# Altium schematic sheet zigbee_easy_module.SchDoc
size A3
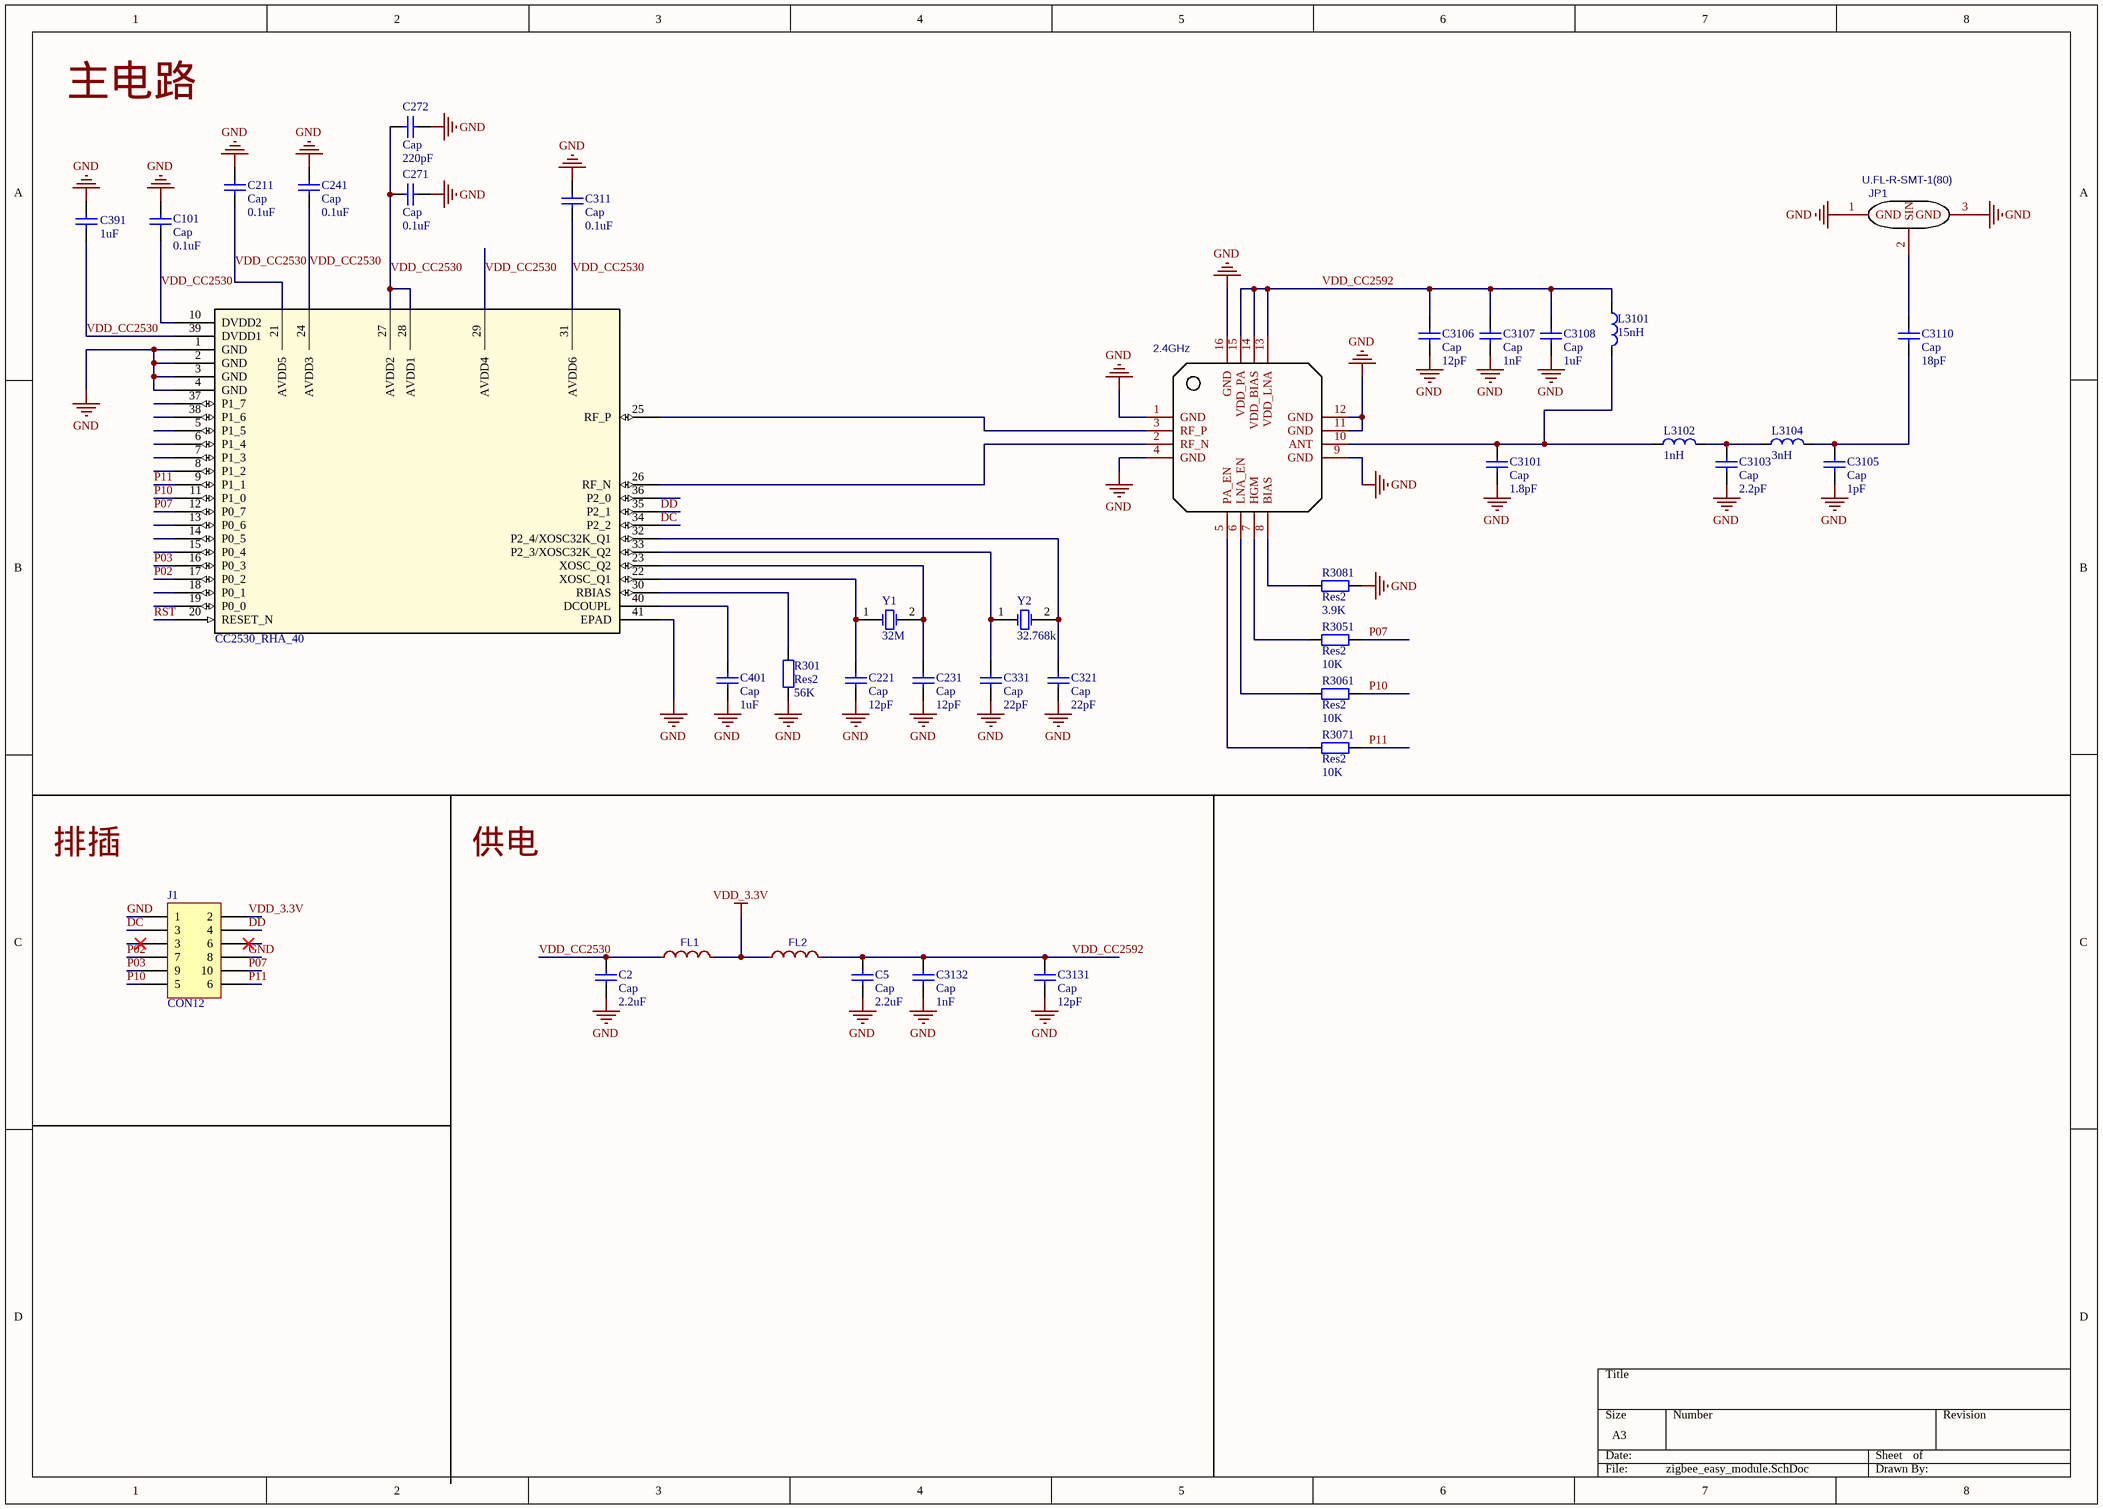
[diagram p0: zigbee_easy_module.SchDoc]

## Parts
(Parts that share a designator on the sheet are numbered #1, #2 ... from top to bottom, then left to right.)
?#1  CC2530_RHA_40  [QFN-40_6X6X05P]
?#2  2.4GHz  [VQFN-16_L4.0-W4.0-P0.65-BL-EP]
C2  Cap  value 2.2uF  [0201]
C5  Cap  value 2.2uF  [0201]
C101  Cap  value 0.1uF  [0201]
C211  Cap  value 0.1uF  [0201]
C221  Cap  value 12pF  [0201]
C231  Cap  value 12pF  [0201]
C241  Cap  value 0.1uF  [0201]
C271  Cap  value 0.1uF  [0201]
C272  Cap  value 220pF  [0201]
C311  Cap  value 0.1uF  [0201]
C321  Cap  value 22pF  [0201]
C331  Cap  value 22pF  [0201]
C391  value 1uF  [0201]
C401  Cap  value 1uF  [0201]
C3101  Cap  value 1.8pF  [0402]
C3103  Cap  value 2.2pF  [0402]
C3105  Cap  value 1pF  [0402]
C3106  Cap  value 12pF  [0201]
C3107  Cap  value 1nF  [0201]
C3108  Cap  value 1uF  [0201]
C3110  Cap  value 18pF  [0402]
C3131  Cap  value 12pF  [0201]
C3132  Cap  value 1nF  [0201]
FL1  (no value)  [0402]
FL2  (no value)  [0402]
J1  CON12  [210S-2.54-2X6P]
JP1  U.FL-R-SMT-1(80)  [U.FL-R-SMT-1(80)]
L3101  15nH  [0402]
L3102  1nH  [0402]
L3104  3nH  [0402]
R301  Res2  value 56K  [0201]
R3051  Res2  value 10K  [0201]
R3061  Res2  value 10K  [0201]
R3071  Res2  value 10K  [0201]
R3081  Res2  value 3.9K  [0201]
Y1  32M  [OSC-SMD_4P-L3.2-W2.5-BL]
Y2  32.768k  [OSC-SMD_L3.2-W1.5]

## Nets
GND: ?#1.1(GND) ?#1.2(GND) ?#1.3(GND) ?#1.4(GND) ?#1.41(EPAD) ?#2.1(GND) ?#2.4(GND) ?#2.9(GND) ?#2.11(GND) ?#2.12(GND) ?#2.16(GND) C2.1 C5.1 C101.1 C211.2 C221.1 C231.1 C241.2 C271.1 C272.1 C311.1 C321.1 C331.1 C391.2 C401.2 C3101.2 C3103.2 C3105.2 C3106.2 C3107.2 C3108.2 C3131.1 C3132.1 J1.1 J1.8 JP1.1(GND) JP1.3(GND) R301.2 R3081.2
VDD_3.3V: FL1.2 FL2.1 J1.2
DC: ?#1.34(P2_2) J1.3
DD: ?#1.35(P2_1) J1.4
P02: ?#1.17(P0_2) J1.7
P03: ?#1.16(P0_3) J1.9
P07: ?#1.12(P0_7) J1.10 R3051.2
P10: ?#1.11(P1_0) J1.5 R3061.2
P11: ?#1.9(P1_1) J1.6 R3071.2
RST: ?#1.20(RESET_N)
VDD_CC2530: ?#1.10(DVDD2) ?#1.21(AVDD5) ?#1.24(AVDD3) ?#1.27(AVDD2) ?#1.28(AVDD1) ?#1.29(AVDD4) ?#1.31(AVDD6) ?#1.39(DVDD1) C2.2 C101.2 C211.1 C241.1 C271.2 C272.2 C311.2 C391.1 FL1.1
VDD_CC2592: ?#2.13(VDD_LNA) ?#2.14(VDD_BIAS) ?#2.15(VDD_PA) C5.2 C3106.1 C3107.1 C3108.1 C3131.2 C3132.2 FL2.2 L3101.1
Net?#1_22: ?#1.22(XOSC_Q1) C221.2 Y1.1(OSC1)
Net?#1_23: ?#1.23(XOSC_Q2) C231.2 Y1.2(OSC2)
Net?#1_25: ?#1.25(RF_P) ?#2.3(RF_P)
Net?#1_26: ?#1.26(RF_N) ?#2.2(RF_N)
Net?#1_30: ?#1.30(RBIAS) R301.1
Net?#1_32: ?#1.32(P2_4/XOSC32K_Q1) C321.2 Y2.2(OSC2)
Net?#1_33: ?#1.33(P2_3/XOSC32K_Q2) C331.2 Y2.1(OSC1)
Net?#1_40: ?#1.40(DCOUPL) C401.1
Net?#2_5: ?#2.5(PA_EN) R3071.1
Net?#2_6: ?#2.6(LNA_EN) R3061.1
Net?#2_7: ?#2.7(HGM) R3051.1
Net?#2_8: ?#2.8(BIAS) R3081.1
Net?#2_10: ?#2.10(ANT) C3101.1 L3101.2 L3102.1
NetC3103_1: C3103.1 L3102.2 L3104.1
NetC3105_1: C3105.1 C3110.2 L3104.2
NetC3110_1: C3110.1 JP1.2(SIN)

Not connected (* = marked no-connect by the designer): ?#1 5(P1_5) 6(P1_4) 7(P1_3) 8(P1_2) 13(P0_6) 14(P0_5) 15(P0_4) 18(P0_1) 19(P0_0) 36(P2_0) 37(P1_7) 38(P1_6)

## Notes on the sheet
- 主电路
- 排插
- 供电

## Library data of the parts
?#1 = CC2530_RHA_40: Imported; Manufacturer: Texas Instruments; GENERIC_PART_NUMBER: CC2530; INDUSTRY_STD_PKG_TYPE: VQFN; FAMILY_NAME: ZigBee RF4CE; PIN_COUNT: 40; PACKAGE_DESIGNATOR: RHA; Datasheet_URL: http://www.ti.com/lit/gpn/CC2530; Value: Value; Type: Type; RefDes: RefDes
?#2 = 2.4GHz: BOM_Manufacturer: TI; BOM_Manufacturer Part: CC2592RGVR; nameAlias: Frequency; SMT Type: Extend; BOM_Supplier: LCSC; image: //image.lceda.cn/szlcsc/C53274.jpg; BOM_Supplier Part: C53274; BOM_LCSC Assembly: Yes; spicePre: U; spiceSymbolName: CC2592RGVR
C2 C5 C101 C211 C221 C231 C241 C271 C272 C311 C321 C331 C391 C401 C3101 C3103 C3105-C3108 C3110 C3131 C3132 = Cap: Capacitor; Published: 8-Jun-2000; LatestRevisionDate: 17-Jul-2002; LatestRevisionNote: Re-released for DXP Platform.; PackageReference: RAD-0.3; Publisher: Altium Limited
FL1 FL2 = (no symbol name): BOM_Manufacturer: MuRata; BOM_Manufacturer Part: BLM18HE152SN1D; nameAlias: Value; SMT Type: Extend; BOM_Supplier: LCSC; BOM_Supplier Part: C82155; BOM_LCSC Assembly: Yes; spicePre: L; spiceSymbolName: BLM18HE152SN1D
J1 = HDR2x6: Connector
JP1 = U.FL-R-SMT-1(80): BOM_Manufacturer: HRS; BOM_Supplier: LCSC; BOM_Manufacturer Part: U.FL-R-SMT-1(80); BOM_Supplier Part: C88374; spicePre: J; spiceSymbolName: U.FL-R-SMT-1(80)
L3101 L3102 L3104 = FB: Ferrite Bead
R301 R3051 R3061 R3071 R3081 = Res2: Resistor; Published: 8-Jun-2000; LatestRevisionDate: 17-Jul-2002; LatestRevisionNote: Re-released for DXP Platform.; PackageReference: AXIAL-0.4; Publisher: Altium Limited
Y1 Y2 = XTAL: Crystal Oscillator; Published: 8-Jun-2000; LatestRevisionDate: 17-Jul-2002; LatestRevisionNote: Re-released for DXP Platform.; PackageReference: R38; Publisher: Altium Limited